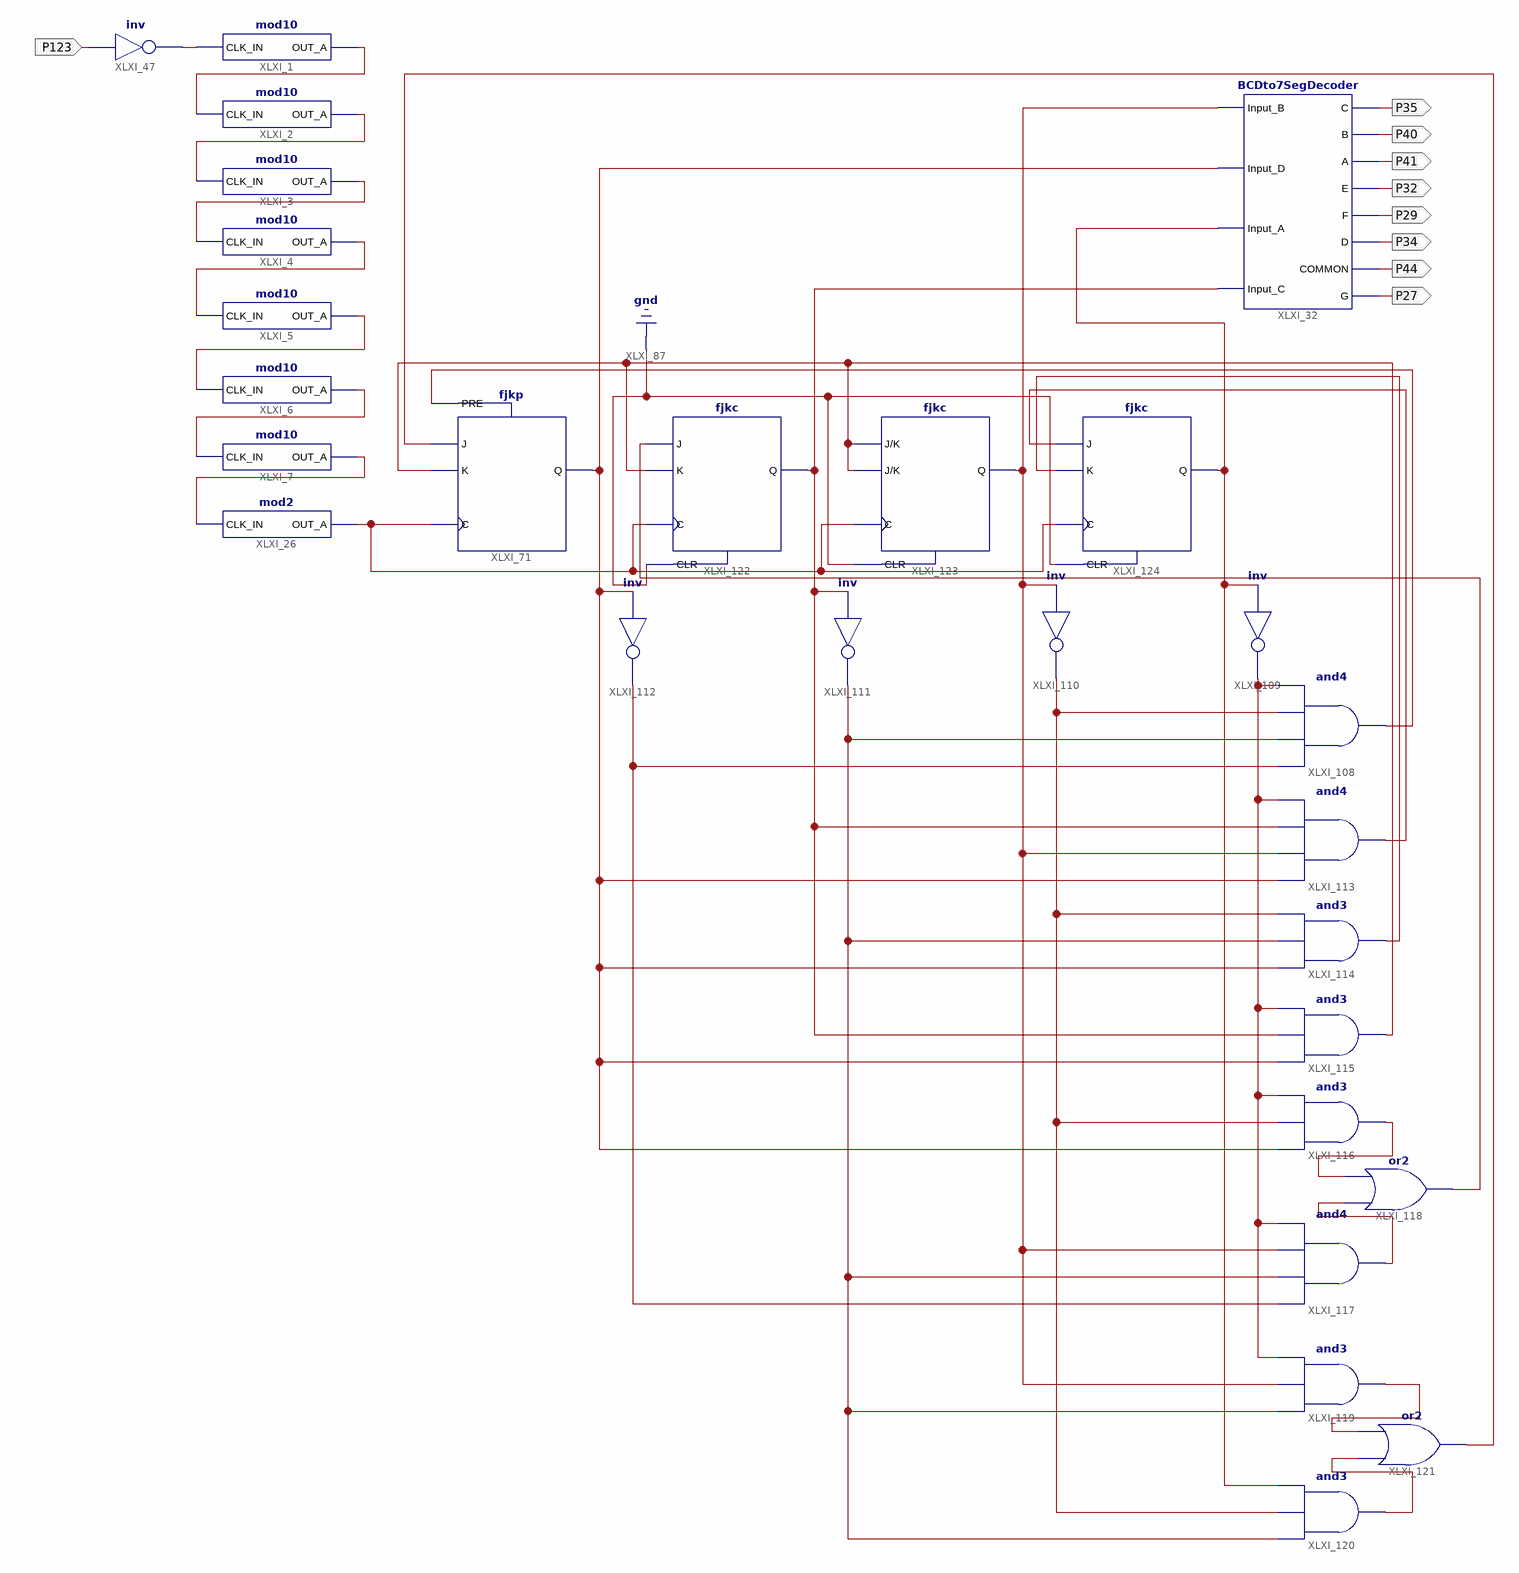
[diagram p0: schematic sheet 1]
// Xilinx ISE schematic Lab5c.sch (spartan6) as structural Verilog: 28 symbols, 9 ports
module Lab5c (
  input  P123,
  output P27,
  output P44,
  output P34,
  output P29,
  output P32,
  output P41,
  output P40,
  output P35
);

  wire XLXN_2, XLXN_4, XLXN_6, XLXN_8, XLXN_10, XLXN_12, XLXN_86, XLXN_326, XLXN_355, XLXN_360, XLXN_363,
       XLXN_365, XLXN_368, XLXN_390, XLXN_392, XLXN_393, XLXN_395, XLXN_410, XLXN_418, XLXN_423, XLXN_432,
       XLXN_440, XLXN_451, XLXN_457, XLXN_460, XLXN_461, XLXN_462;

  mod10 XLXI_1 (.CLK_IN(XLXN_326), .OUT_A(XLXN_2));
  mod10 XLXI_2 (.CLK_IN(XLXN_2), .OUT_A(XLXN_4));
  mod10 XLXI_3 (.CLK_IN(XLXN_4), .OUT_A(XLXN_6));
  mod10 XLXI_4 (.CLK_IN(XLXN_6), .OUT_A(XLXN_8));
  mod10 XLXI_5 (.CLK_IN(XLXN_8), .OUT_A(XLXN_10));
  mod10 XLXI_6 (.CLK_IN(XLXN_10), .OUT_A(XLXN_12));
  mod10 XLXI_7 (.CLK_IN(XLXN_12), .OUT_A(XLXN_86));
  mod2 XLXI_26 (.CLK_IN(XLXN_86), .OUT_A(XLXN_355));
  fjkp XLXI_71 (.C(XLXN_355), .J(XLXN_462), .K(XLXN_423), .PRE(XLXN_395), .Q(XLXN_360));
  not XLXI_47 (XLXN_326, P123);
  BCDto7SegDecoder XLXI_32 (
    .Input_B(XLXN_365), .Input_D(XLXN_360), .Input_A(XLXN_368), .Input_C(XLXN_363), .C(P35), .B(P40),
    .A(P41), .E(P32), .F(P29), .D(P34), .COMMON(P44), .G(P27));
  and XLXI_108 (XLXN_395, XLXN_393, XLXN_392, XLXN_457, XLXN_390);
  not XLXI_109 (XLXN_390, XLXN_368);
  not XLXI_110 (XLXN_457, XLXN_365);
  not XLXI_111 (XLXN_392, XLXN_363);
  not XLXI_112 (XLXN_393, XLXN_360);
  and XLXI_113 (XLXN_410, XLXN_360, XLXN_365, XLXN_363, XLXN_390);
  and XLXI_114 (XLXN_418, XLXN_360, XLXN_392, XLXN_457);
  and XLXI_115 (XLXN_423, XLXN_360, XLXN_363, XLXN_390);
  and XLXI_116 (XLXN_432, XLXN_360, XLXN_457, XLXN_390);
  and XLXI_117 (XLXN_440, XLXN_393, XLXN_392, XLXN_365, XLXN_390);
  or XLXI_118 (XLXN_451, XLXN_440, XLXN_432);
  and XLXI_119 (XLXN_460, XLXN_392, XLXN_365, XLXN_390);
  and XLXI_120 (XLXN_461, XLXN_392, XLXN_457, XLXN_368);
  or XLXI_121 (XLXN_462, XLXN_461, XLXN_460);
  fjkc XLXI_122 (.C(XLXN_355), .CLR(1'b0), .J(XLXN_451), .K(XLXN_423), .Q(XLXN_363));
  fjkc XLXI_123 (.C(XLXN_355), .CLR(1'b0), .J(XLXN_423), .K(XLXN_423), .Q(XLXN_365));
  fjkc XLXI_124 (.C(XLXN_355), .CLR(1'b0), .J(XLXN_410), .K(XLXN_418), .Q(XLXN_368));
endmodule
